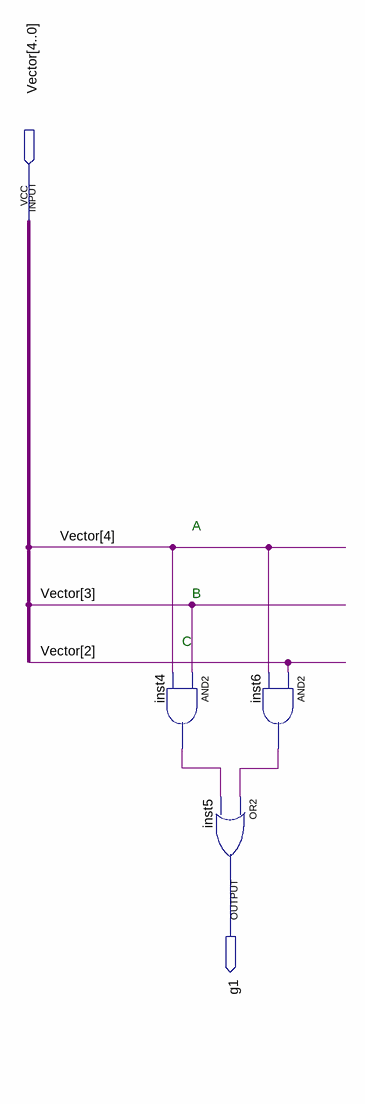
[diagram p0: schematic sheet]
// Quartus schematic g1.bdf as structural Verilog: 3 symbols, 2 pins
module g1 (
  input  [4:0] Vector,
  output g1
);

  wire inst4_out, inst6_out;

  and inst4 (inst4_out, Vector[3], Vector[4]);
  and inst6 (inst6_out, Vector[2], Vector[4]);
  or inst5 (g1, inst6_out, inst4_out);

  // Notes on the sheet:
  //   A
  //   B
  //   C
endmodule
